# EAGLE design DevBoard (EAGLE 6.1)
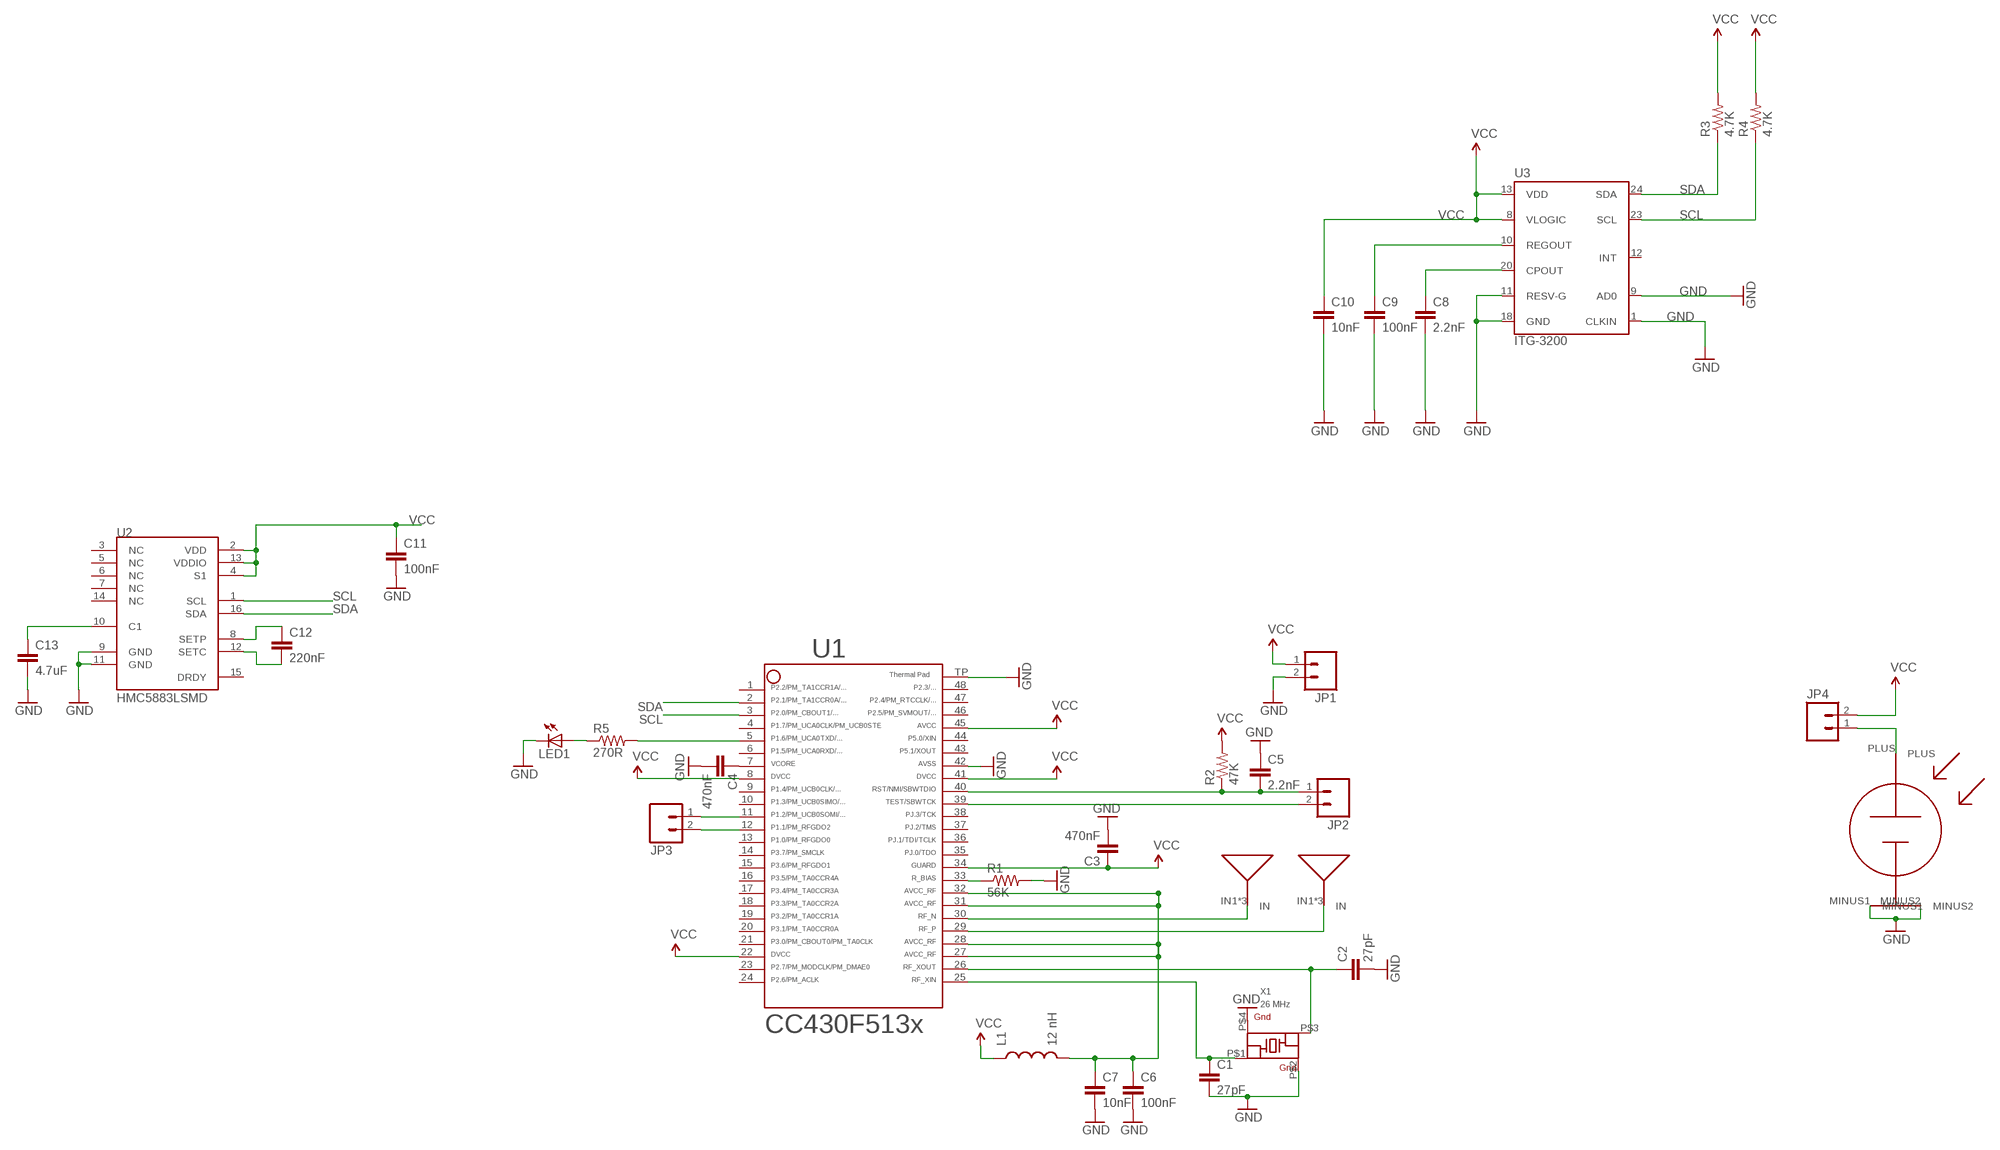
[diagram p0: schematic, sheet 1]

## Parts
ANT-N  ANTENNA  [ANTENNA]
ANT-P  ANTENNA  [ANTENNA]
C1  27pF  CAP0603-CAP  [0603-CAP]
C2  27pF  CAP0603-CAP  [0603-CAP]
C3  470nF  CAP0603-CAP  [0603-CAP]
C4  470nF  CAP0603-CAP  [0603-CAP]
C5  2.2nF  CAP0603-CAP  [0603-CAP]
C6  100nF  CAP0603-CAP  [0603-CAP]
C7  10nF  CAP0603-CAP  [0603-CAP]
C8  2.2nF  CAP0603-CAP  [0603-CAP]
C9  100nF  CAP0603-CAP  [0603-CAP]
C10  10nF  CAP0603-CAP  [0603-CAP]
C11  100nF  CAP0603-CAP  [0603-CAP]
C12  220nF  CAP0603-CAP  [0603-CAP]
C13  4.7uF  CAP0603-CAP  [0603-CAP]
JP1  M02PTH  [1X02]
JP2  M02PTH  [1X02]
JP3  M02PTH  [1X02]
JP4  M02PTH  [1X02]
L1  12 nH  INDUCTOR0603  [0603]
LED1  LED0603  [LED-0603]
R1  56K  RESISTOR0603-RES  [0603-RES]
R2  47K  RESISTOR0603-RES  [0603-RES]
R3  4.7K  RESISTOR0603-RES  [0603-RES]
R4  4.7K  RESISTOR0603-RES  [0603-RES]
R5  270R  RESISTOR0603-RES  [0603-RES]
S1  TASC  [TASC]
U1  CC430F5137  CC430F513X---RGZ48  [RGZ48]
U2  HMC5883LSMD  [16LPCC]
U3  ITG-3200  [QFN-24]
X1  26 MHz  ABM11_CERAMIC_SMD_CRYSTALABM11  [ABM11_CERAMIC-SMD-CRYSTAL]

## Nets
GND: C1.2 C2.2 C3.2 C4.2 C5.1 C6.2 C7.2 C8.2 C9.2 C10.2 C11.2 C13.2 JP1.2 LED1.C R1.2 S1.MINUS1 S1.MINUS2 U1.42 U1.TP U2.9(GND) U2.11(GND) U3.1(CLKIN) U3.9(AD0) U3.11(RESV-G) U3.18(GND) X1.P$2(GROUND2) X1.P$4(GROUND4)
N$1: C2.1 U1.26 X1.P$3
N$2: C1.1 U1.25 X1.P$1
N$3: R1.1 U1.33
N$4: C4.1 U1.7
N$5: C12.1 U2.8(SETP)
N$6: C12.2 U2.12(SETC)
N$7: C13.1 U2.10(C1)
N$8: C8.1 U3.20(CPOUT)
N$9: C9.1 U3.10(REGOUT)
N$10: R5.2 U1.5
N$11: LED1.A R5.1
RFN: ANT-N.IN1(IN) ANT-N.IN2(IN) ANT-N.IN3(IN) U1.30
RFP: ANT-P.IN1(IN) ANT-P.IN2(IN) ANT-P.IN3(IN) U1.29
RST: C5.2 JP2.1 R2.1 U1.40
RXD: JP3.2 U1.12
SCL: R4.1 U1.3 U2.1(SCL) U3.23(SCL)
SDA: R3.1 U1.2 U2.16(SDA) U3.24(SDA)
TEST: JP2.2 U1.39
TXD: JP3.1 U1.11
VCC: C3.1 C10.1 C11.1 JP1.1 JP4.2 L1.1 R2.2 R3.2 R4.2 U1.8 U1.22 U1.34 U1.41 U1.45 U2.2(VDD) U2.4(S1) U2.13(VDDIO) U3.8(VLOGIC) U3.13(VDD)
VCCRF: C6.1 C7.1 L1.2 U1.27 U1.28 U1.31 U1.32
VSOLAR: JP4.1 S1.PLUS
Unconnected: U1.1 U1.4 U1.6 U1.9 U1.10 U1.13 U1.14 U1.15 U1.16 U1.17 U1.18 U1.19 U1.20 U1.21 U1.23 U1.24 U1.35 U1.36 U1.37 U1.38 U1.43 U1.44 U1.46 U1.47 U1.48 U2.3(NC) U2.5(NC) U2.6(NC) U2.7(NC) U2.14(NC) U2.15(DRDY) U3.12(INT)

## Library data of the parts
ANT-N ANT-P = SpriteAntenna:ANTENNA
C1-C13 = SparkFun:CAP: Capacitor Standard 0603 ceramic capacitor, and 0.1" leaded capacitor.
JP1-JP4 = SparkFun:M02: Header 2 Standard 2-pin 0.1" header. Use with straight break away headers (SKU : PRT-00116), right angle break away headers (PRT-00553), swiss pins (PRT-00743), machine pins (PRT-00117), and female headers (PRT-00115). Molex polarized connector foot print use with SKU : PRT-08233 with associated crimp pins and housings.
L1 = SparkFun:INDUCTOR: Inductors Basic Inductor/Choke - 0603 and 1206. Footprints are not proven and vary greatly between part numbers.
LED1 = SparkFun:LED: LEDs Standard schematic elements and footprints for 5mm, 3mm, 1206, and 0603 sized LEDs. 5mm - Spark Fun Electronics SKU : COM-00529 (and others)
R1-R5 = SparkFun:RESISTOR: Resistor Basic schematic elements and footprints for 0603, 1206, and PTH resistors.
S1 = TASC:TASC
U1 = TI_MSP430_v16:CC430F513X---RGZ48: ***CC430F513X***RGZ48 ** ** Rev 1.0 ** 06/2010 * http://focus.ti.com/docs/prod/folders/print/cc430f5137.html
U2 = SparkFun:HMC5883L: 3 Axis Digital Compass IC
U3 = SparkFun:ITG-3200: ITG-3200 3-axis gyro, digital output, qfn24 package
X1 = ABM11:ABM11_CERAMIC_SMD_CRYSTAL: ABM11 Crystal

## Board
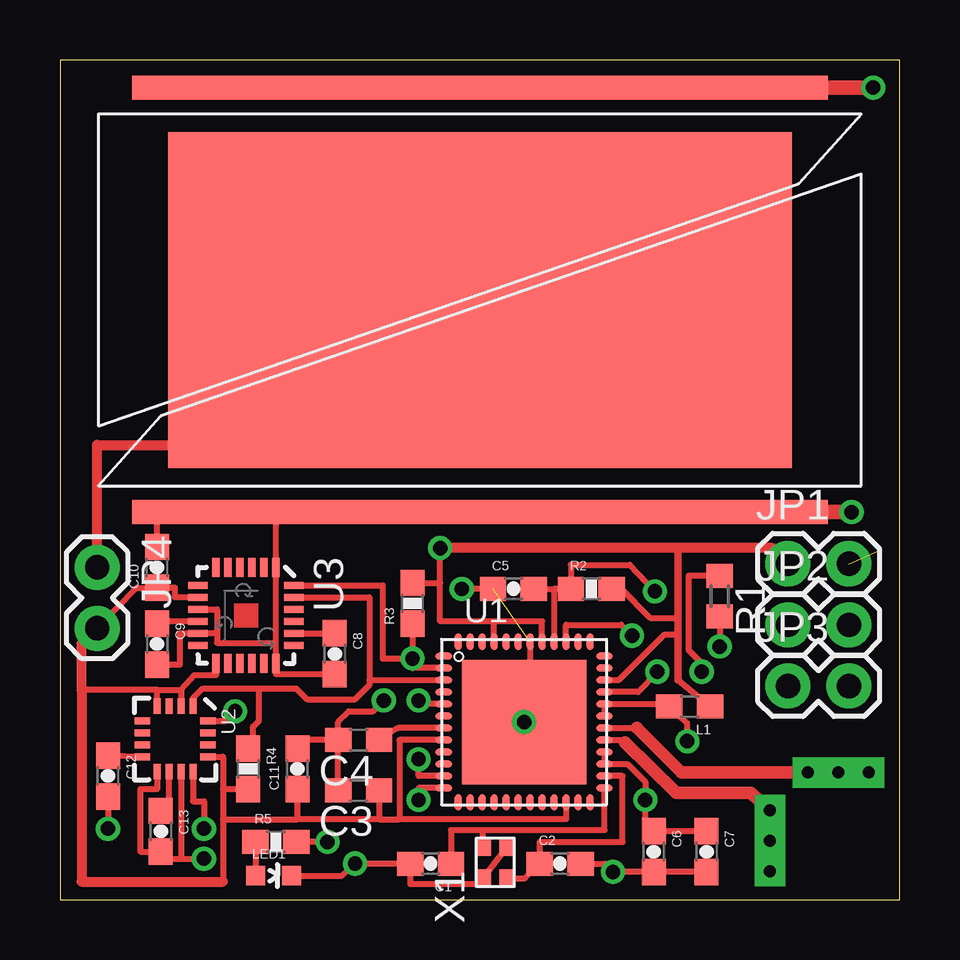
[diagram p1: board, top side]
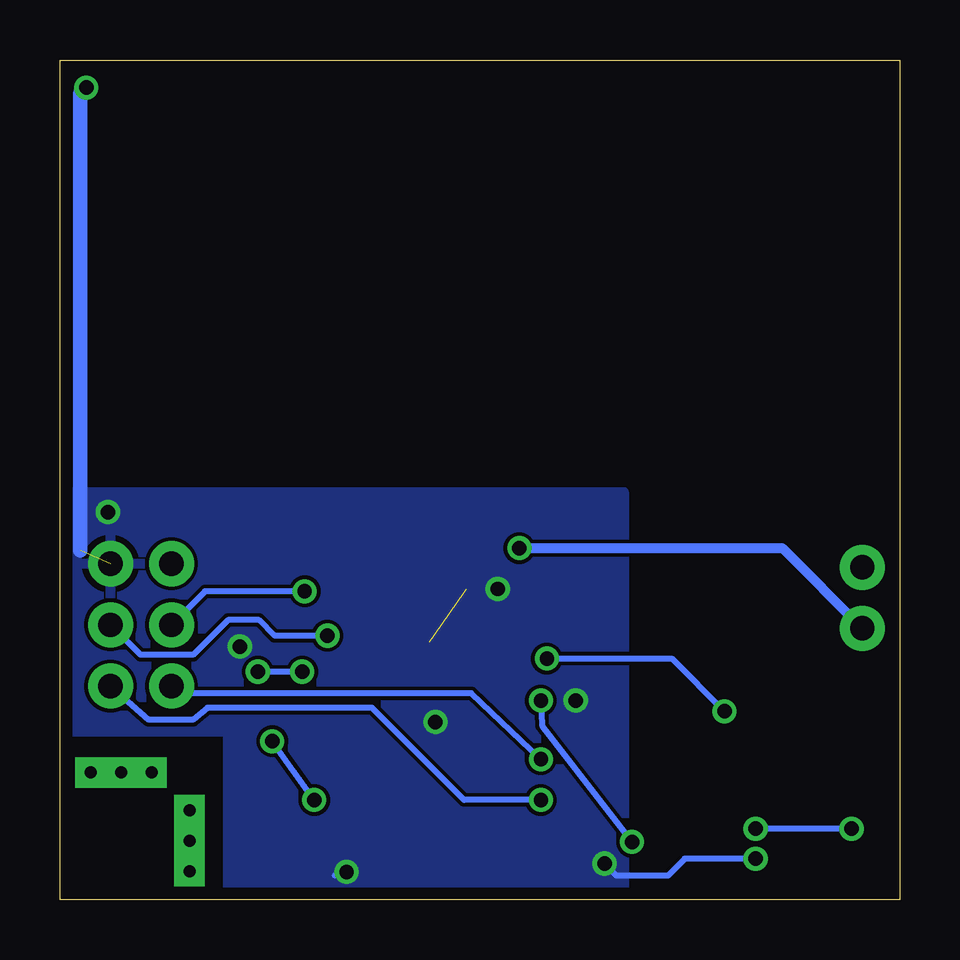
[diagram p2: board, bottom side, seen from below]

Size 35 x 35 mm. Coordinates in mm from the lower left corner, seen from the top.
Outline: 0,0 35,0 35,35 0,35 0,0
Copper layers (1*16): Top 0.0178mm / dielectric 59mil / Bottom 0.0178mm
Design rules: minimum track width 6mil, minimum drill 14mil, track to track 6mil, track to pad 6mil, pad to pad 6mil, via to via 6mil, smd to smd 6mil, copper to edge 20mil, drill to drill 16mil, minimum pad ring 8mil, minimum via ring 8mil, stop-mask expansion 3mil, vias tented up to drill 0mil, thermal gap 10mil

### Footprints (pad centres in the part's own frame; a part is rotated, then mirrored left to right if it is on the bottom)
ANTENNA = drill 0.5 pad 1.27 square: IN1 1.27,0; IN2 0,0; IN3 -1.27,0
0603-CAP = smd 1.1 x 1: 1 -0.85,0; 2 0.85,0
C0603 = smd 1.1 x 1: 1 -0.85,0; 2 0.85,0
1X02 = drill 1.016 pad 1.88: 1 0,0; 2 2.54,0
0603 = smd 1.1 x 1: 1 -0.85,0; 2 0.85,0
LED-0603 = smd 0.8 x 0.8: A 0,-0.75; C 0,0.75
R0603 = smd 1 x 1.1: 1 -0.85,0; 2 0.85,0
0603-RES = smd 1.1 x 1: 1 -0.85,0; 2 0.85,0
TASC = smd 29 x 1: MINUS1 15.9,16.6; MINUS2 15.9,-1.1 | smd 26 x 14: PLUS 15.9,7.75
RGZ48 = smd 0.7 x 0.3: 1 -3.35,2.75; 2 -3.35,2.25; 3 -3.35,1.75; 4 -3.35,1.25; 5 -3.35,0.75; 6 -3.35,0.25; 7 -3.35,-0.25; 8 -3.35,-0.75; 9 -3.35,-1.25; 10 -3.35,-1.75; 11 -3.35,-2.25; 12 -3.35,-2.75; 25 3.35,-2.75; 26 3.35,-2.25; 27 3.35,-1.75; 28 3.35,-1.25; 29 3.35,-0.75; 30 3.35,-0.25; 31 3.35,0.25; 32 3.35,0.75; 33 3.35,1.25; 34 3.35,1.75; 35 3.35,2.25; 36 3.35,2.75 | smd 0.3 x 0.7: 13 -2.75,-3.35; 14 -2.25,-3.35; 15 -1.75,-3.35; 16 -1.25,-3.35; 17 -0.75,-3.35; 18 -0.25,-3.35; 19 0.25,-3.35; 20 0.75,-3.35; 21 1.25,-3.35; 22 1.75,-3.35; 23 2.25,-3.35; 24 2.75,-3.35; 37 2.75,3.35; 38 2.25,3.35; 39 1.75,3.35; 40 1.25,3.35; 41 0.75,3.35; 42 0.25,3.35; 43 -0.25,3.35; 44 -0.75,3.35; 45 -1.25,3.35; 46 -1.75,3.35; 47 -2.25,3.35; 48 -2.75,3.35 | smd 5.2 x 5.2: TP 0,0
16LPCC = smd 0.65 x 0.28: 1 -1.37,0.75; 2 -1.37,0.25; 3 -1.37,-0.25; 4 -1.37,-0.75; 9 1.37,-0.75; 10 1.37,-0.25; 11 1.37,0.25; 12 1.37,0.75 | smd 0.28 x 0.65: 5 -0.75,-1.37; 6 -0.25,-1.37; 7 0.25,-1.37; 8 0.75,-1.37; 13 0.75,1.37; 14 0.25,1.37; 15 -0.25,1.37; 16 -0.75,1.37
QFN-24 = smd 0.8 x 0.3: 1 -2,1.25; 2 -2,0.75; 3 -2,0.25; 4 -2,-0.25; 5 -2,-0.75; 6 -2,-1.25; 13 2,-1.25; 14 2,-0.75; 15 2,-0.25; 16 2,0.25; 17 2,0.75; 18 2,1.25 | smd 0.3 x 0.8: 7 -1.25,-2; 8 -0.75,-2; 9 -0.25,-2; 10 0.25,-2; 11 0.75,-2; 12 1.25,-2; 19 1.25,2; 20 0.75,2; 21 0.25,2; 22 -0.25,2; 23 -0.75,2; 24 -1.25,2
ABM11_CERAMIC-SMD-CRYSTAL = smd 0.762 x 0.66: P$1 0.66,0.508; P$2 0.66,-0.508; P$3 -0.66,-0.508; P$4 -0.66,0.508

### Placement (x,y rotation side)
ANT-N  32.45,5.3 180 top
ANT-P  29.6,2.45 90 top
C1  15.45,1.5 180 top
C2  20.85,1.5 0 top
C3  470nF  [C0603]  12.45,4.55 180 top
C4  470nF  [C0603]  12.45,6.65 180 top
C5  18.9,12.95 0 top
C6  24.75,2 270 top
C7  26.95,2 270 top
C8  11.45,10.25 270 top
C9  4.05,10.65 270 top
C10  4.05,13.85 90 top
C11  9.9,5.45 90 top
C12  2,5.15 270 top
C13  4.2,2.85 270 top
JP1  30.35,14 0 top
JP2  30.35,11.45 0 top
JP3  30.35,8.9 0 top
JP4  1.55,13.85 270 top
L1  26.25,8.05 180 top
LED1  8.9,1 270 top
R1  56K  [R0603]  27.5,12.65 270 top
R2  22.15,12.95 0 top
R3  14.7,12.35 90 top
R4  7.85,5.45 270 top
R5  9,2.4 0 top
S1  1.6,17.25 0 top
U1  19.35,7.4 0 top
U2  4.8,6.7 270 top
U3  7.75,11.85 270 top
X1  18.15,1.55 90 top

### Tracks (layer width: path | path; a pad name or v marks a point on that pad's centre or on a via)
GND  (via drill 0.6, 0.6 pad 0.25)  (2 unrouted)
  Top 0.254: C3.2 C4.2 | C13.2 4.3,1.7 5.05,1.7 | 5.05,1.7 v6,1.7 | U2.9 4.05,4.6 3.35,4.6 3.35,2 C13.2 | C13.2 4.55,2.3 | U2.11 5.05,1.7 | 9,16.05 U3.1 9,10.7 | 9,16.05 32.95,16.15 | C8.2 9,9.4 U3.18 9,10.7 | C5.1 v16.75,12.95 | U1.42 19.6,7.75 U1.TP | R1.2 v27.5,10.55 | C7.2 C6.2 | C6.2 24.8,1.1 | C6.2 v23.05,1.15 22.7,1.5 C2.2 | LED1.C 11.75,1 v12.3,1.5 C1.2 14.6,0.65 17.65,0.65 X1.P$4 | X1.P$4 | X1.P$4 X1.P$2 | C9.2 5,9.8 5,11.1 U3.11 6.55,11.1 | U3.9 6.55,12.1 6.55,11.1 | 6.55,11.1 6.55,10.7 9,10.7 | C10.2 4.05,16.15 9,16.15 9,16.05 | C4.2 9.9,6.65 C11.2 | C4.2 11.6,7.4 12.05,7.85 13.05,7.85 v13.5,8.3
  Top 0.406: S1.MINUS2 12.4,16.15
  Top 0.61: S1.MINUS2 32.95,16.15 v33,16.15 | S1.MINUS1 v33.9,33.85
  Bottom 0.254: v16.75,12.95 16.4,13.05 16.95,12.7 | 11.95,1.4 11.95,1.35 v12.3,1.5 11.8,1 LED1.C 8.95,1.7 v6,1.7 | v23.05,1.15 23.55,1
  Bottom 0.61: 34.15,14.55 34.15,33.6 v33.9,33.85
  other vias: 19.35,7.4
  pour Bottom: 11.5,17 11.5,0 28,0 28,7 35,7 34.95,17
N$1
  Top 0.254: U1.26 23.45,5.15 23.45,2.4 20,2.4 C2.1 19.39,0.89 X1.P$3
N$2
  Top 0.254: 17.65,2.9 16.3,2.9 C1.1 | 17.65,2.9 22.7,2.9 U1.25 | X1.P$1 17.64,2.89 17.65,2.9
N$3  (via drill 0.6)
  Top 0.254: R1.1 26.2,13.5 26.2,10.4 26.75,9.85 v26.75,9.5 | U1.33 24.1,8.65 v24.9,9.5
  Bottom 0.254: v24.9,9.5 v26.75,9.5
N$4
  Top 0.254: U1.7 14.1,7.15 C4.1
N$5
  Top 0.254: U2.8 C12.1 2.1,6
N$6  (via drill 0.6)
  Top 0.254: C12.2 v2,2.95 | U2.12 5.55,4.1 6,4.1 v6,2.95
  Bottom 0.254: v2,2.95 v6,2.95
N$7
  Top 0.254: C13.1 4.55,3.55 U2.10
N$8
  Top 0.254: U3.20 C8.1 11.65,11.25
N$9
  Top 0.254: U3.10 4.1,11.6 C9.1
N$10  (via drill 0.6)
  Top 0.254: U1.5 15.1,8.15 v14.95,8.3 | v11.15,2.4 R5.2
  Bottom 0.254: v14.95,8.3 14.9,7.25 v11.15,2.4
N$11
  Top 0.254: R5.1 LED1.A
RFN
  Top 0.254: U1.30 24.05,7.15
  Top 0.53: ANT-N.IN3 ANT-N.IN2 ANT-N.IN1 25.9,5.3 24.05,7.15
RFP
  Top 0.254: 29.6,3.7 ANT-P.IN1 | U1.29 23.45,6.65 23.55,6.55
  Top 0.53: ANT-P.IN3 ANT-P.IN2 29.6,3.7 28.8,4.45 25.7,4.45 23.55,6.55
RST  (via drill 0.6)
  Top 0.254: R2.1 21.3,13 | C5.2 R2.1 | R2.1 21.3,13.95 23.75,13.95 v24.8,12.85 | R2.1 20.6,12.95 U1.40
  Bottom 0.254: v24.8,12.85 28.95,12.85 JP2.1
RXD  (via drill 0.6)
  Top 0.254: U1.12 14.95,4.65 v14.95,4.15
  Bottom 0.254: v14.95,4.15 18.15,4.15 22,8 28.85,8 29.45,7.5 31.3,7.5 JP3.2
SCL
  Top 0.254: 12.9,9.15 U1.3 | U3.23 12.9,12.6 12.9,9.15 | 12.9,9.15 12.9,8.95 12.3,8.35 10.3,8.35 9.85,8.8 8.3,8.8 | U2.1 5.55,8.4 5.95,8.8 8.3,8.8 | R4.1 8.05,6.3 8.05,7.2 8.3,7.45 8.3,8.8
SDA  (via drill 0.6)
  Top 0.254: U3.24 13.45,13.1 13.45,10.05 v14.7,10.05 | R3.1 v14.7,10.05 | U1.2 14.7,9.65 v14.7,10.05 | U2.16 6.9,7.45 v7.3,7.85
  Bottom 0.254: v14.7,10.05 9.5,10.05 v7.3,7.85
TEST  (via drill 0.6)
  Top 0.254: U1.39 21.1,11.45 23.4,11.45 v23.85,11
  Bottom 0.254: v23.85,11 26.05,11 26.7,11.65 28,11.65 29.45,10.2 31.64,10.2 JP2.2
TXD  (via drill 0.6)
  Top 0.254: U1.11 14.95,5.15 v14.95,5.85
  Bottom 0.254: v14.95,5.85 17.85,8.6 30.05,8.6 JP3.1
VCC  (via drill 0.6)
  Top 0.254: U2.4 4.05,8.75 | 4.05,8.75 5.05,8.75 | 5.05,8.75 U2.2 | U2.13 6.8,5.95 6.8,4.6 | 6.8,4.6 6.8,3.35 | 6.8,3.35 6.8,0.75 | 4.05,8.75 0.9,8.75 | U3.13 6.5,9.35 5.6,9.35 5.05,8.75 | R4.2 6.8,4.6 | U1.8 14.15,6.65 14.15,3.35 | R2.2 23.4,12.95 24.6,11.75 25.65,11.75 25.75,11.85 | U1.45 18.1,11.6 | 18.1,11.6 15.85,11.6 15.85,13.2 | 15.85,13.2 v15.85,14.65 | U1.41 20.1,11.6 18.1,11.6 | U1.22 21.1,3.35 14.15,3.35 | C3.1 13.3,3.35 | 13.3,3.35 14.15,3.35 | 6.8,3.35 9.9,3.35 | 9.9,3.35 C11.1 | 13.3,3.35 9.9,3.35 | 25.75,9.15 L1.1 | U1.34 23.3,9.15 25.2,11.05 25.7,11.05 25.75,11 | U3.8 4.8,12.6 4.8,13 C10.1 3.2,13 JP4.2 | R3.2 15.85,13.2
  Top 0.305: 25.75,14.65 25.75,11.85 25.75,11 25.75,9.15
  Top 0.406: v15.85,14.65 25.75,14.65 29.7,14.65 JP1.1 | 6.8,0.75 0.9,0.75 0.9,8.75 0.9,10.66 JP4.2
  Bottom 0.406: v15.85,14.65 4.89,14.65 JP4.2
VCCRF  (via drill 0.6)
  Top 0.254: U1.32 U1.31 | 22.75,7.65 U1.32 | v26.15,6.6 26.15,7.35 L1.2 25.45,8.15 U1.32 | U1.28 U1.27 23.65,5.65 24.4,4.9 v24.4,4.15 24.4,2.75 C6.1 C7.1
  Bottom 0.254: v24.4,4.15 v26.15,6.6
VSOLAR
  Top 0.406: JP4.1 1.55,18.95 17.5,18.95 S1.PLUS